# Altium project Dikey_İnis_Sensor_BoardV3.1.PrjPcb
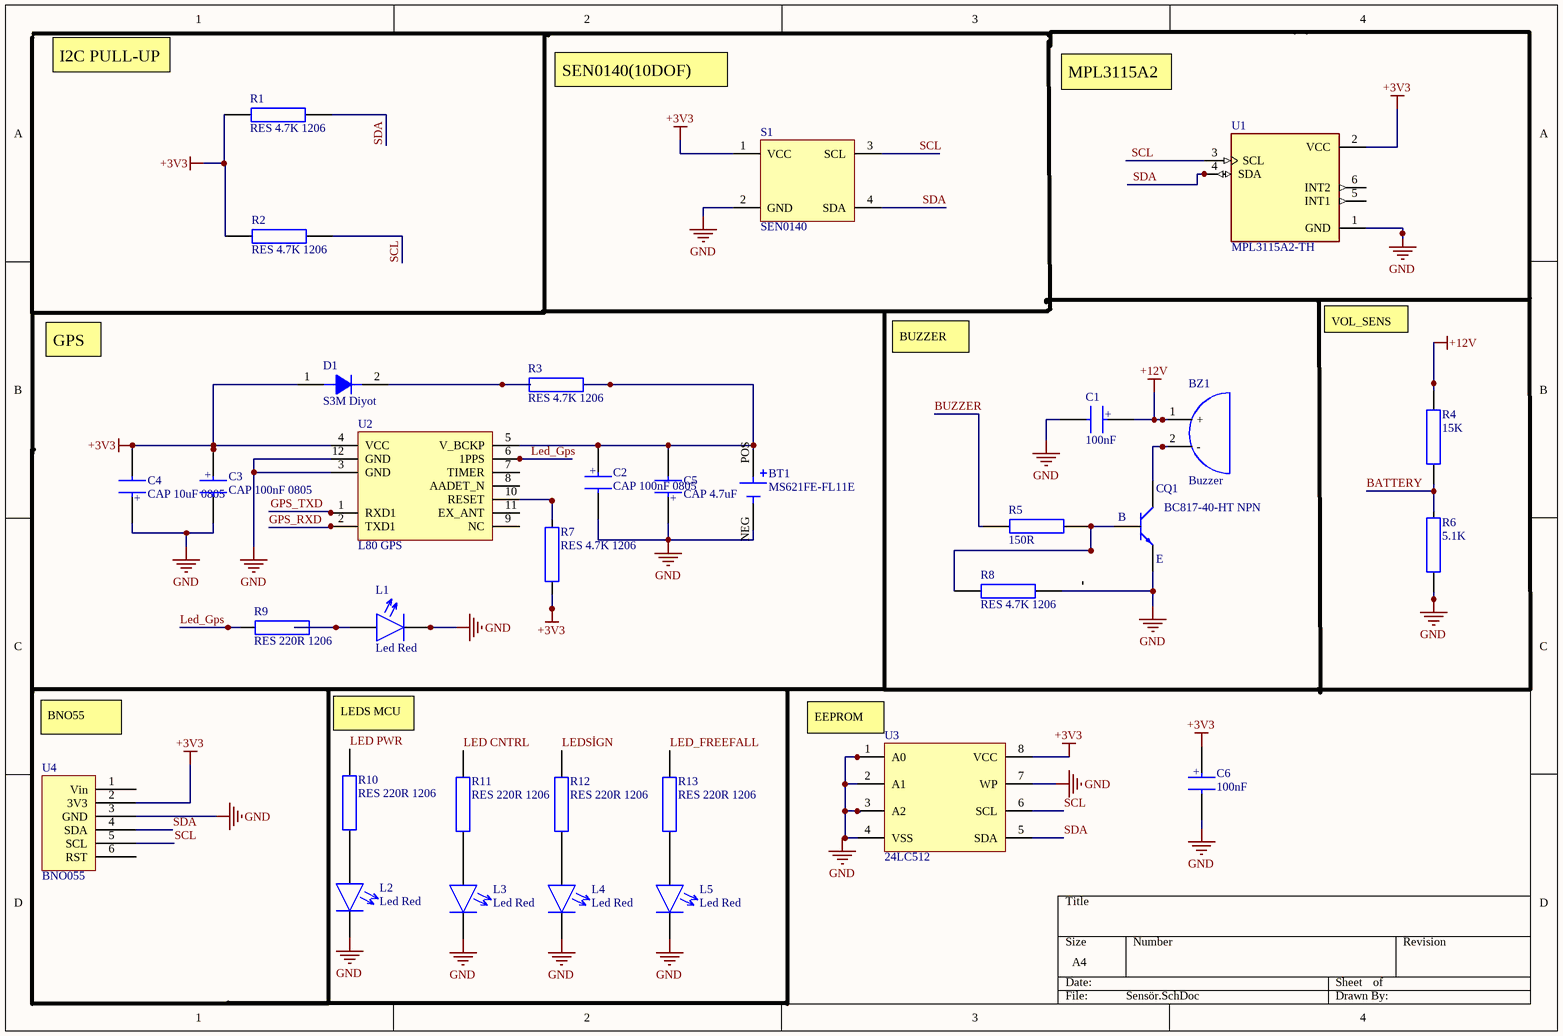
[diagram p0: Sensör.SchDoc]
3 sheets, 56 parts. Net scope: global (net labels, ports and power ports of the same name join across sheets).
Board file: PCB2.PcbDoc
Sheets:
  Sensör.SchDoc
  Mikroişlemci.SchDoc
  Güç.SchDoc

## Sheet Sensör.SchDoc
size A4; SheetNumber: 1; SheetTotal: 3

### Parts
BT1  MS621FE-FL11E  [BAT_MS621FE-FL11E]
BZ1  Buzzer  [CMI-9605IC]
C1  100nF  [CAP_805]
C2  CAP 100nF 0805  [CAP_805]
C3  CAP 100nF 0805  [CAP_805]
C4  CAP 10uF 0805  [CAP_805]
C5  CAP 4.7uF  [CAP_805]
C6  100nF  [CAP_805]
D1  S3M Diyot  [DO214AA]
L1  Led Red  [Led 1206]
L2  Led Red  [Led 1206]
L3  Led Red  [Led 1206]
L4  Led Red  [Led 1206]
L5  Led Red  [Led 1206]
Q1  BC817-40-HT NPN  [SOT-23]
R1  RES 4.7K 1206  [RES_1206]
R2  RES 4.7K 1206  [RES_1206]
R3  RES 4.7K 1206  [RES_1206]
R4  15K  [RES_1206]
R5  150R  [RES_1206]
R6  5.1K  [RES_1206]
R7  RES 4.7K 1206  [RES_1206]
R8  RES 4.7K 1206  [RES_1206]
R9  RES 220R 1206  [RES_1206]
R10  RES 220R 1206  [RES_1206]
R11  RES 220R 1206  [RES_1206]
R12  RES 220R 1206  [RES_1206]
R13  RES 220R 1206  [RES_1206]
S1  SEN0140  [SEN0140]
U1  MPL3115A2-TH  [MPL3115A2]
U2  L80 GPS  [L-80]
U3  24LC512  [soic-8]
U4  BNO055  [BNO055]

### Nets
+3V3: C3.1 C4.2 C6.1 D1.1 R1.2 R2.2 R7.1 S1.1(VCC) U1.2(VCC) U2.4(VCC) U3.8(VCC) U4.2(3V3)
+12V: BZ1.1(+) C1.1 R4.1
BATTERY: BT1.NEG C1.2 C2.2 C3.2 C4.1 C5.1 C6.2 L1.2 L2.2 L3.2 L4.2 L5.2 Q1.2 R4.2 R6.1 R6.2 R8.1 S1.2(GND) U1.1(GND) U2.3(GND) U2.12(GND) U3.1(A0) U3.2(A1) U3.3(A2) U3.4(VSS) U3.7(WP) U4.3(GND)  [also labelled GND]
BUZZER: R5.2
GPS_RXD: U2.2(TXD1)
GPS_TXD: U2.1(RXD1)
LED CNTRL: R11.2
LED PWR: R10.2
LED_FREEFALL: R13.2
Led_Gps: R9.1 U2.6(1PPS)
LEDSİGN: R12.2
SCL: R2.1 S1.3(SCL) U1.3(SCL) U3.6(SCL) U4.5(SCL)
SDA: R1.1 S1.4(SDA) U1.4(SDA) U3.5(SDA) U4.4(SDA)
NetBT1_POS: BT1.POS C2.1 C5.2 R3.2 U2.5(V_BCKP)
NetBZ1_2: BZ1.2(-) Q1.3
NetD1_2: D1.2 R3.1
NetL1_1: L1.1 R9.2
NetL2_1: L2.1 R10.1
NetL3_1: L3.1 R11.1
NetL4_1: L4.1 R12.1
NetL5_1: L5.1 R13.1
NetQ1_1: Q1.1 R5.1 R8.2
NetR7_2: R7.2 U2.10(RESET)

Not connected (* = marked no-connect by the designer): U1 5(INT1) 6(INT2); U2 7(TIMER) 8(AADET_N) 9(NC) 11(EX_ANT); U4 1(Vin) 6(RST)

### Notes on the sheet
- I2C PULL-UP
- SEN0140(10DOF)
- MPL3115A2
- GPS
- BUZZER
- VOL_SENS
- BNO55
- LEDS MCU
- (near U3) EEPROM
- (in symbol BC817-40-HT NPN) C; B; E
- (in symbol CAP 2.2uF) +
- (in symbol CAP 10uF 0805) +
- (in symbol CAP 100nF 0805) +

### Library data of the parts
BT1 = MS621FE-FL11E: Coin, 6.8mm 3V Lithium Battery Rechargeable (Secondary) 5.5mAh; MF: Seiko Instruments; SnapEDA_Link: https://www.snapeda.com/parts/MS621FE-FL11E/Seiko%20Instruments/view-part/6886595/?ref=snap; MP: MS621FE-FL11E; Availability: In Stock; Price: None; Check_prices: https://www.snapeda.com/parts/MS621FE-FL11E/Seiko%20Instruments/view-part/6886595/?ref=eda; Value: *; Purchase-URL: https://pricing.snapeda.com/search/part/MS621FE-FL11E/?ref=eda; Package: QFP-128 Seiko
BZ1 = BUZZER: Designed by: Ahmet Azboy
C1-C3 C6 = CAP 100nF 0805: 0805 smd
C4 = CAP 10uF 0805: 0805 smd
C5 = CAP 2.2uF: 0805 smd
D1 = S3M Diyot: Current: 3A; Voltage: 1000V; Case/Package: DO214AA
Q1 = BC817-40-HT NPN: Current: 500 mA; Voltage: 45V; Case/Package: SOT-23
R4 R6 = RES 1K 1206
R5 = RES 4.7K 1206
S1 = SEN0140: 10 DOF IMU
U2 = L80 GPS: Name: Quetcel L80; Designed By: Ahmet Azboy
U3 = 24LC512: EEPROM Serial-2Wire 512K-bit 64K x 8 3.3V/5V 8-Pin SOIJ Tube / IC EEPROM 512KBIT 400KHZ 8SOIJ; Manufacturer: Microchip; Manufacturer Part Number: 24LC512-I/SM; Access Time: 900ns; Memory Size: 512Kb; Nominal Supply Current: 5mA; Interface: I2C,Serial,2-Wire; Max Supply Voltage: 5.5V; Min Supply Voltage: 2.5V; Organization: 64KX8; Write Protection: YES; Write Cycle Time-Max (tWC): 5ms; Designed by: Ahmet Azboy; Supplier 1: RSComponents; RoHS: Yes; Category: EEPROM; Stock 1: 53; Pricing 1: 90=1,48900 (GBP); Mount: Surface Mount; Case/Package: SOIC; Number of Pins: 8; Min Operating Temperature: -40°C; Max Operating Temperature: 85°C; Packaging: Rail/Tube; Frequency: 400kHz; Density: 512Kb; Package Quantity: 90; Memory Type: EEPROM; Max Frequency: 400kHz; Access Time-Max: 900ns; Supply Current: 5mA; Programming Voltage: 5.5V; Supply Voltage-Nom: 5.5V; Length: 5.21mm; Width: 5.28mm; Height: 1.88mm; Radiation Hardening: No; Lead Free: Lead Free; RoHS Compliant: Yes; REACH SVHC: No SVHC; ComponentLink1URL: https://datasheet.ciiva.com/26870/24lc512-i-sm-26870738.pdf?src-supplier=IIIC; ComponentLink1Description: https://datasheet.ciiva.com/26870/24lc512-i-sm-26870738.pdf?src-supplier=IIIC; ComponentLink2URL: https://datasheet.ciiva.com/29294/160414-da-01-en-eeprom-24lc512-i-sm-microchip-29294348.pdf?src-supplier=Conrad; ComponentLink2Description: https://datasheet.ciiva.com/29294/160414-da-01-en-eeprom-24lc512-i-sm-microchip-29294348.pdf?src-supplier=Conrad; ComponentLink3URL: https://datasheet.ciiva.com/17651/21754m-17651369.pdf?src-supplier=Avnet+Europe; ComponentLink3Description: https://datasheet.ciiva.com/17651/21754m-17651369.pdf?src-supplier=Avnet+Europe; ComponentLink4URL: https://datasheet.ciiva.com/1155/1688094-1155274.pdf?src-supplier=Element14; ComponentLink4Description: https://datasheet.ciiva.com/1155/1688094-1155274.pdf?src-supplier=Element14; ComponentLink5URL: https://datasheet.ciiva.com/1155/1688094-1155275.pdf?src-supplier=Element14; ComponentLink5Description: https://datasheet.ciiva.com/1155/1688094-1155275.pdf?src-supplier=Element14; ComponentLink6URL: https://datasheet.ciiva.com/3184/21754m-3184956.pdf?src-supplier=Avnet; ComponentLink6Description: https://datasheet.ciiva.com/3184/21754m-3184956.pdf?src-supplier=Avnet; ComponentLink7URL: https://datasheet.ciiva.com/16921/70045251-16921949.pdf?src-supplier=Allied+Electronics; ComponentLink7Description: https://datasheet.ciiva.com/16921/70045251-16921949.pdf?src-supplier=Allied+Electronics; ComponentLink8URL: https://datasheet.ciiva.com/16304/filehandler-aspxddocname-en546203-16304574.pdf?src-supplier=Future+Electronics; ComponentLink8Description: https://datasheet.ciiva.com/16304/filehandler-aspxddocname-en546203-16304574.pdf?src-supplier=Future+Electronics; Supplier Part Number 1: 8895724

## Sheet Mikroişlemci.SchDoc
size A4; SheetNumber: 2; SheetTotal: 3
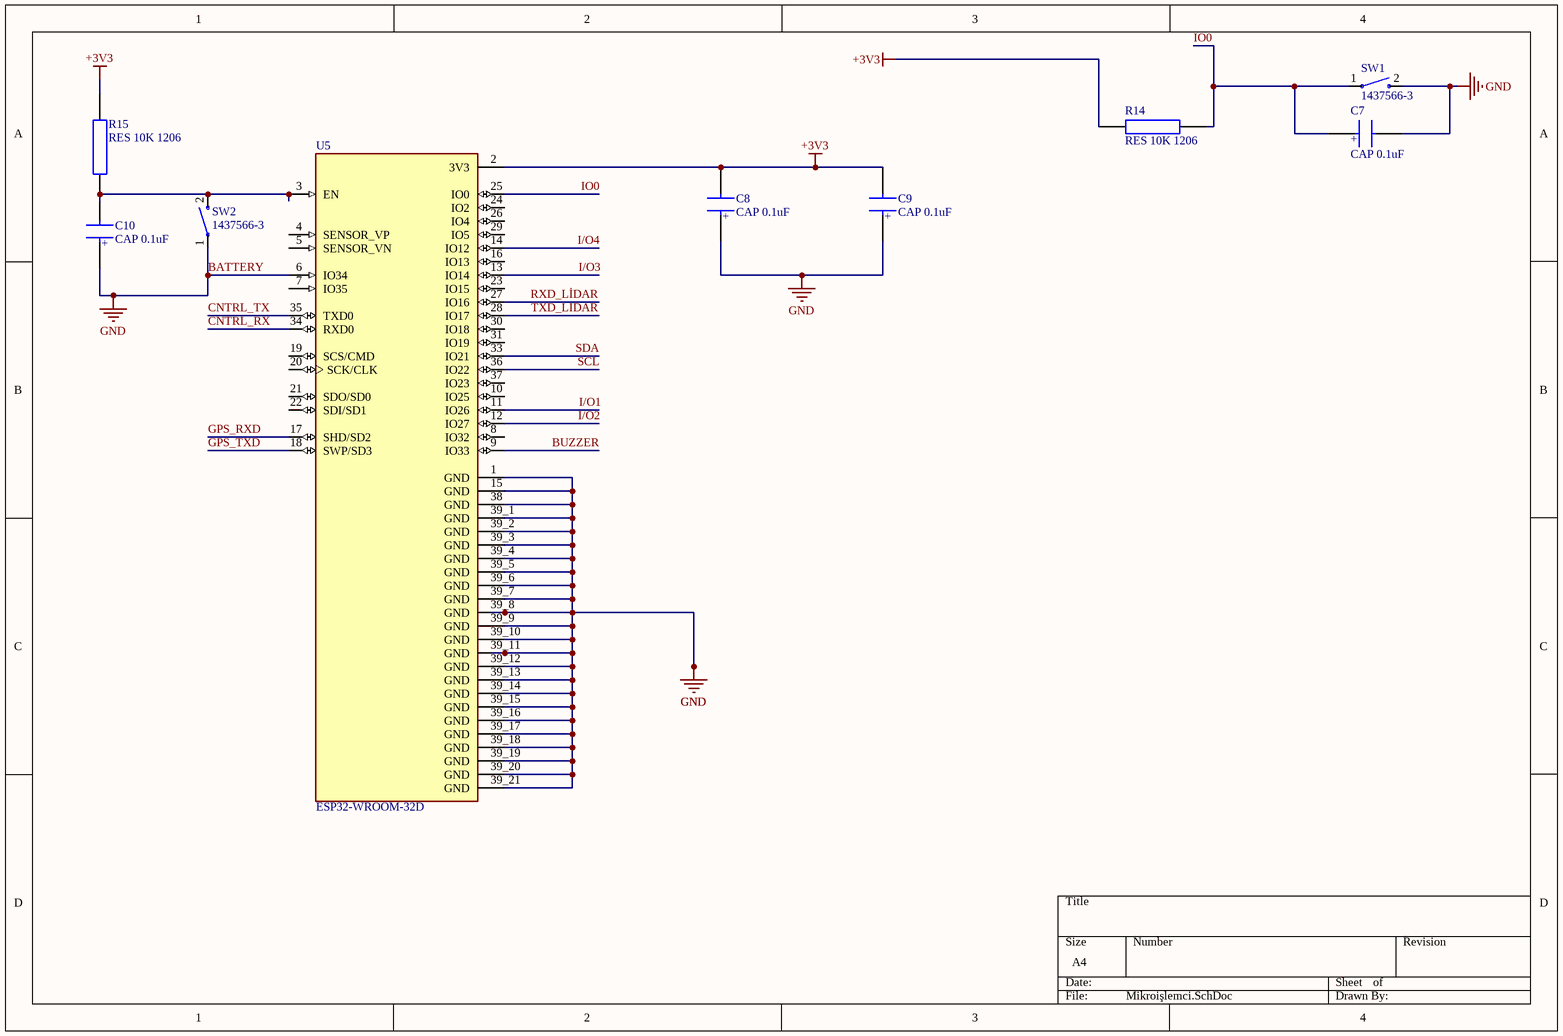
[diagram p1: Mikroişlemci.SchDoc]

### Parts
C7  CAP 0.1uF  [CAP_805]
C8  CAP 0.1uF  [CAP_805]
C9  CAP 0.1uF  [CAP_805]
C10  CAP 0.1uF  [CAP_805]
R14  RES 10K 1206  [RES_1206]
R15  RES 10K 1206  [RES_1206]
SW1  1437566-3  [SW_1437566-3]
SW2  1437566-3  [SW_1437566-3]
U5  ESP32-WROOM-32D  [MODULE_ESP32-WROOM-32D]

### Nets
+3V3: C8.2 C9.2 R14.2 R15.2 U5.2(3V3)
BATTERY: C7.2 C8.1 C9.1 C10.1 SW1.2 SW2.1 U5.1(GND) U5.6(IO34) U5.15(GND) U5.38(GND) U5.39_1(GND) U5.39_2(GND) U5.39_3(GND) U5.39_4(GND) U5.39_5(GND) U5.39_6(GND) U5.39_7(GND) U5.39_8(GND) U5.39_9(GND) U5.39_10(GND) U5.39_11(GND) U5.39_12(GND) U5.39_13(GND) U5.39_14(GND) U5.39_15(GND) U5.39_16(GND) U5.39_17(GND) U5.39_18(GND) U5.39_19(GND) U5.39_20(GND) U5.39_21(GND)  [also labelled GND]
BUZZER: U5.9(IO33)
CNTRL_RX: U5.34(RXD0)
CNTRL_TX: U5.35(TXD0)
GPS_RXD: U5.17(SHD/SD2)
GPS_TXD: U5.18(SWP/SD3)
I/O1: U5.11(IO26)
I/O2: U5.12(IO27)
I/O3: U5.13(IO14)
I/O4: U5.14(IO12)
IO0: C7.1 R14.1 SW1.1 U5.25(IO0)
RXD_LİDAR: U5.27(IO16)
SCL: U5.36(IO22)
SDA: U5.33(IO21)
TXD_LİDAR: U5.28(IO17)
NetC10_2: C10.2 R15.1 SW2.2 U5.3(EN)

Not connected (* = marked no-connect by the designer): U5 4(SENSOR_VP) 5(SENSOR_VN) 7(IO35) 8(IO32) 10(IO25) 16(IO13) 19(SCS/CMD) 20(SCK/CLK) 21(SDO/SD0) 22(SDI/SD1) 23(IO15) 24(IO2) 26(IO4) 29(IO5) 30(IO18) 31(IO19) 37(IO23)

### Notes on the sheet
- (in symbol CAP 1uF) +

### Library data of the parts
C7-C10 = CAP 1uF: 0805 smd
SW1 SW2 = 1437566-3: Switch Tactile OFF (ON) SPST Rectangular Button Gull Wing 0.05A 12VDC SMD Loose Piece; Price: None; Value: *; Package: None; Availability: Unavailable; MP: 1437566-3
U5 = ESP32-WROOM-32D: Bluetooth, WiFi 802.11b/g/n, Bluetooth v4.2 +EDR, Class 1, 2 and 3 Transceiver Module 2.4GHz ~ 2.5GHz Integrated; MF: Espressif Systems; Price: None; Availability: In Stock; Package: Module Espressif Systems; MP: ESP32-WROOM-32D; Value: *; SnapEDA_Link: https://www.snapeda.com/parts/ESP32-WROOM-32D/Espressif+Systems/view-part/?ref=snap; Purchase-URL: https://pricing.snapeda.com/search/part/ESP32-WROOM-32D/?ref=eda; Check_prices: https://www.snapeda.com/parts/ESP32-WROOM-32D/Espressif+Systems/view-part/?ref=eda

## Sheet Güç.SchDoc
size A4; SheetNumber: 3; SheetTotal: 3
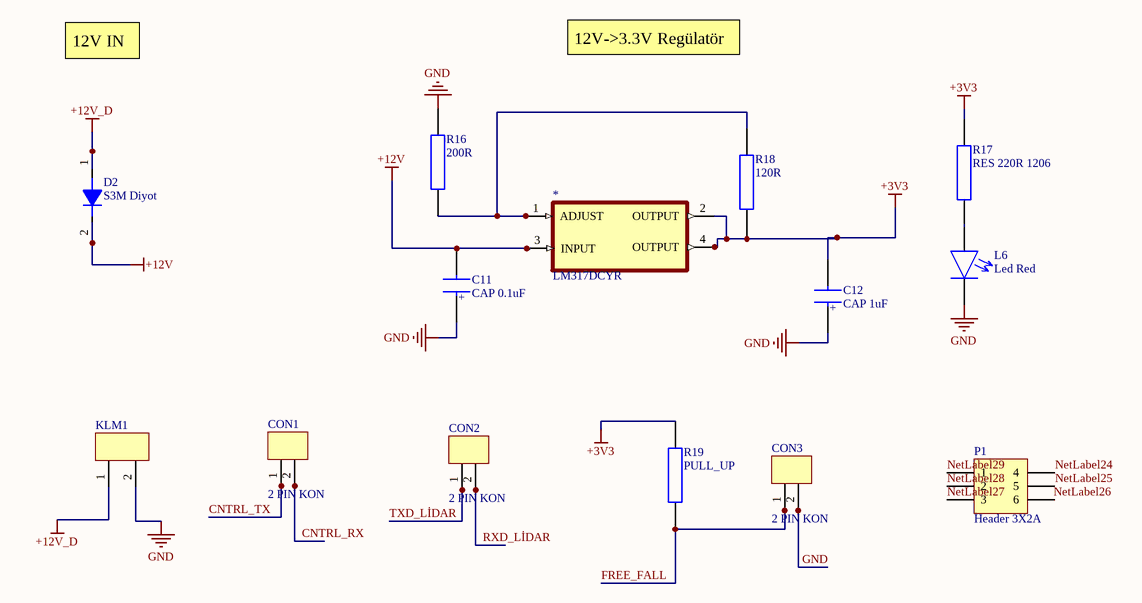
[diagram p2: Güç.SchDoc]

### Parts
*  LM317DCYR  [SOT230P700X180-4N]
C11  CAP 0.1uF  [CAP_805]
C12  CAP 1uF  [CAP_805]
CON1  2 PIN KON  [2 PIN 2.54MM]
CON2  2 PIN KON  [2 PIN 2.54MM]
CON3  2 PIN KON  [2 PIN 2.54MM]
D2  S3M Diyot  [DO214AA]
KLM1  2 Pin Klemens  [5.08mm-2 pin]  (value not drawn)
L6  Led Red  [Led 1206]
P1  Header 3X2A  [HDR2X3_CEN]
R16  200R  [RES_1206]
R17  RES 220R 1206  [RES_1206]
R18  120R  [RES_1206]
R19  PULL_UP  [RES_1206]

### Nets
+3V3: *.2(OUTPUT) *.4(OUTPUT) C12.2 R17.2 R18.2 R19.2
+12V: *.3(INPUT) C11.2 D2.2
+12V_D: D2.1 KLM1.1
GND: C11.1 C12.1 CON3.2 KLM1.2 L6.2 R16.2  [project net BATTERY]
CNTRL_RX: CON1.2
CNTRL_TX: CON1.1
FREE_FALL: CON3.1 R19.1
NetLabel24: P1.4
NetLabel25: P1.5
NetLabel27: P1.3
NetLabel28: P1.2
NetLabel29: P1.1
RXD_LİDAR: CON2.2
TXD_LİDAR: CON2.1
Net*_1: *.1(ADJUST) R16.1 R18.1
NetL6_1: L6.1 R17.1

Not connected (* = marked no-connect by the designer): P1 6

### Notes on the sheet
- 12V IN
- 12V->3.3V Regülatör
- Labels drawn without touching a wire or pin: NetLabel26
- (in symbol CAP 1uF) +

### Library data of the parts
C11 C12 = CAP 1uF: 0805 smd
CON1-CON3 = 2 PIN KON: 2.54 mm vertical
D2 = S3M Diyot: Current: 3A; Voltage: 1000V; Case/Package: DO214AA
KLM1 = 2 Pin Klemens: 5.08mm 2 pin klemens
P1 = Header 3X2A: Header, 3-Pin, Dual row; LatestRevisionDate: 17-Jul-2002; LatestRevisionNote: Re-released for DXP Platform.; Publisher: Altium Limited
R16 R18 = RES 820R 1206
R19 = RES 4.7K 1206

## Nets that join several sheets
+3V3: Sensör (12 pins), Mikroişlemci (5 pins), Güç (6 pins)
+12V: Sensör (BZ1.1 C1.1 R4.1), Güç (*.3 C11.2 D2.2)
BATTERY: Sensör (27 pins), Mikroişlemci (31 pins), Güç (6 pins)
BUZZER: Sensör (R5.2), Mikroişlemci (U5.9)
CNTRL_RX: Mikroişlemci (U5.34), Güç (CON1.2)
CNTRL_TX: Mikroişlemci (U5.35), Güç (CON1.1)
GPS_RXD: Sensör (U2.2), Mikroişlemci (U5.17)
GPS_TXD: Sensör (U2.1), Mikroişlemci (U5.18)
RXD_LİDAR: Mikroişlemci (U5.27), Güç (CON2.2)
SCL: Sensör (5 pins), Mikroişlemci (U5.36)
SDA: Sensör (5 pins), Mikroişlemci (U5.33)
TXD_LİDAR: Mikroişlemci (U5.28), Güç (CON2.1)